# EAGLE design esp32_guitar_tuner (EAGLE 9.6.2)
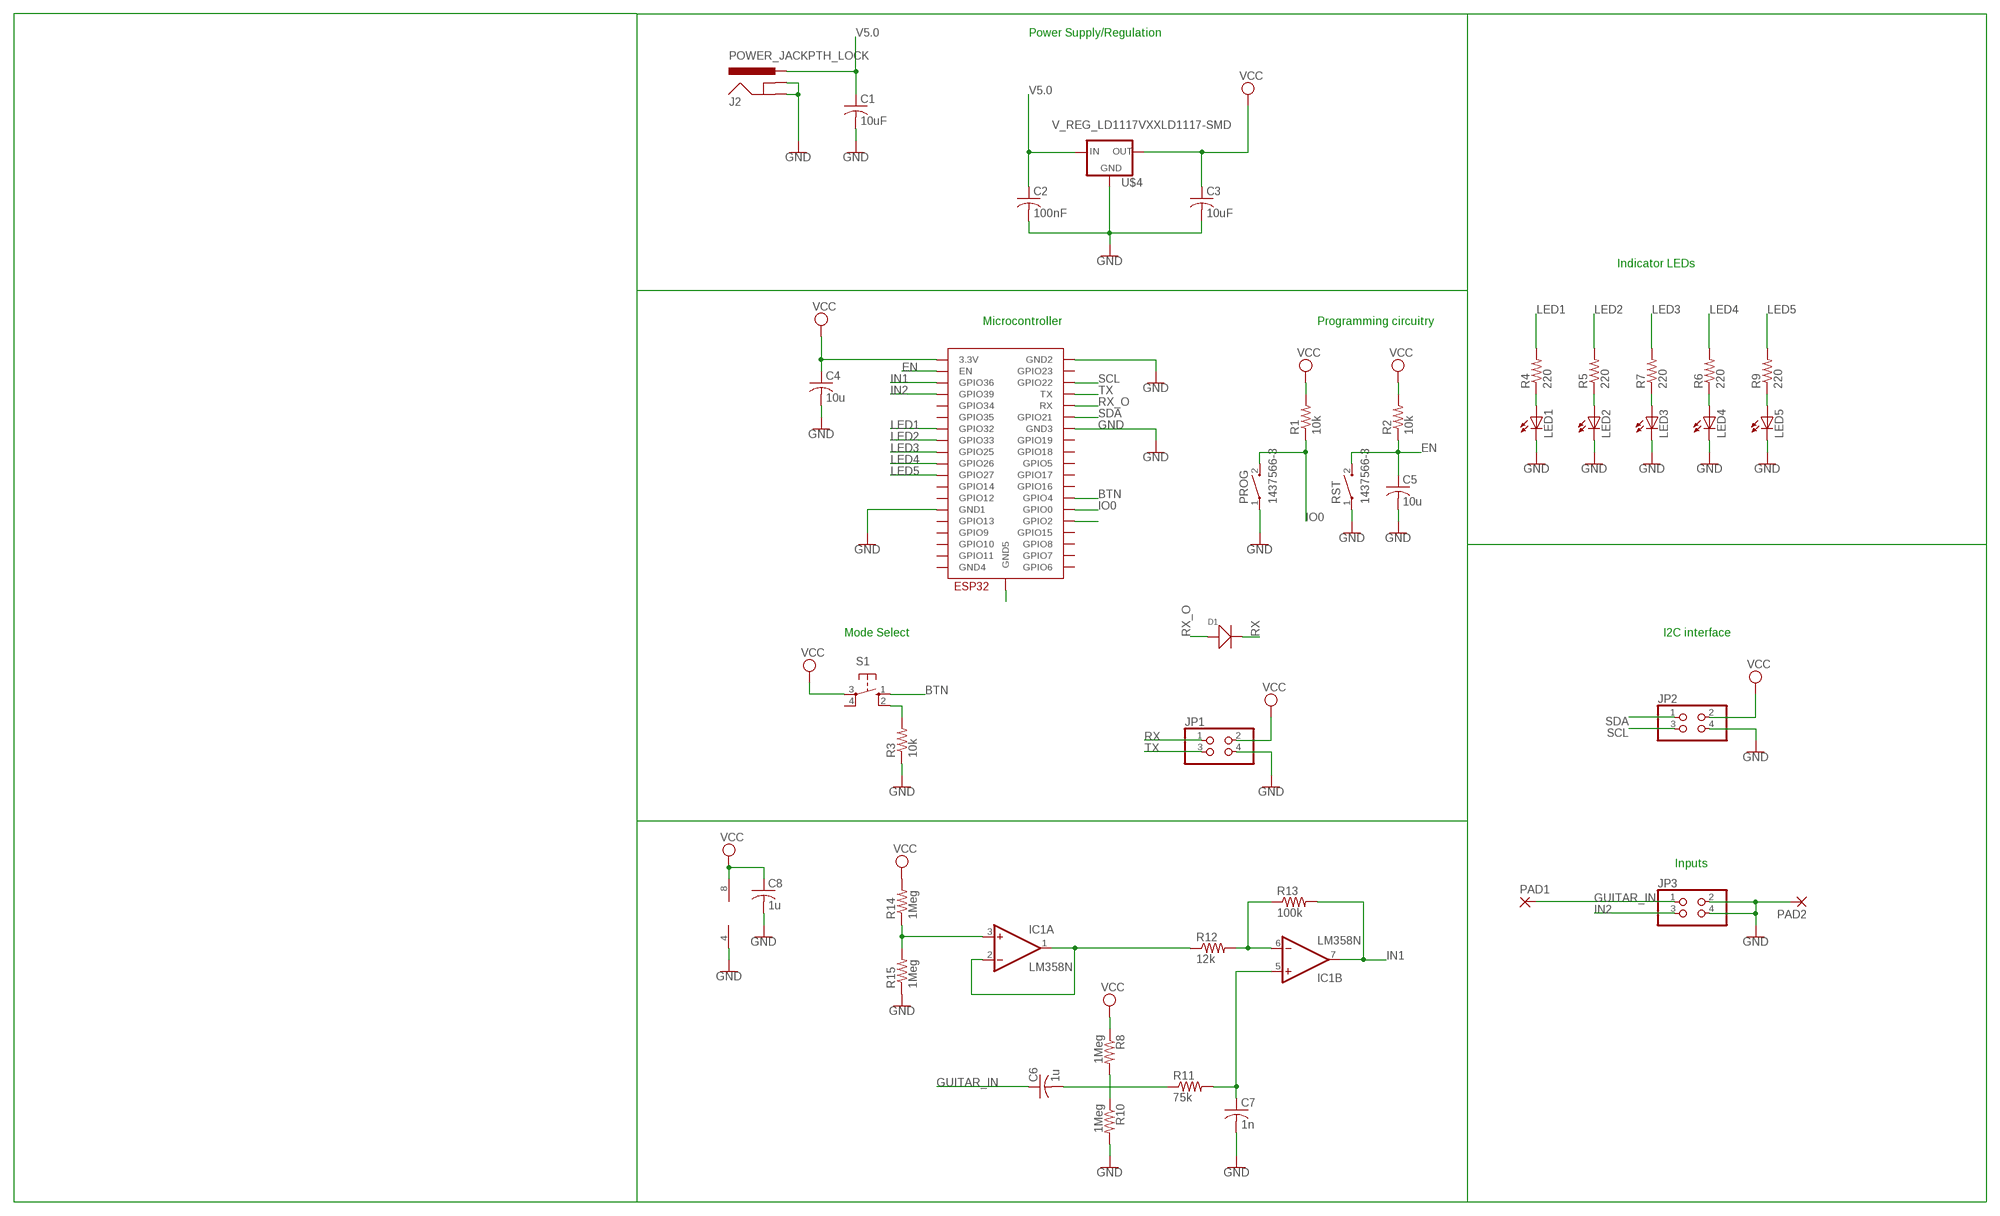
[diagram p0: schematic, sheet 1]

## Parts
C1  10uF  C-USC0805  [C0805]
C2  100nF  C-USC0805  [C0805]
C3  10uF  C-USC0805  [C0805]
C4  10u  C-USC0805  [C0805]
C5  10u  C-USC0805  [C0805]
C6  1u  C-USC0805  [C0805]
C7  1n  C-USC0805  [C0805]
C8  1u  C-USC0805  [C0805]
D1  DIODE'0805'  [SOD-323]
IC1  LM358N  [DIL08]
J2  POWER_JACKPTH_LOCK  [POWER_JACK_PTH_LOCK]
JP1  PINHD-2X2  [2X02]
JP2  PINHD-2X2  [2X02]
JP3  PINHD-2X2  [2X02]
LED1  LEDCHIPLED_0805  [CHIPLED_0805]
LED2  LEDCHIPLED_0805  [CHIPLED_0805]
LED3  LEDCHIPLED_0805  [CHIPLED_0805]
LED4  LEDCHIPLED_0805  [CHIPLED_0805]
LED5  LEDCHIPLED_0805  [CHIPLED_0805]
PAD1  SMD5  [SMD2,54-5,08]
PAD2  SMD5  [SMD2,54-5,08]
PROG  1437566-3  [SW_1437566-3]
R1  10k  R-US_R0805  [R0805]
R2  10k  R-US_R0805  [R0805]
R3  10k  R-US_R0805  [R0805]
R4  220  R-US_R0805  [R0805]
R5  220  R-US_R0805  [R0805]
R6  220  R-US_R0805  [R0805]
R7  220  R-US_R0805  [R0805]
R8  1Meg  R-US_R0805  [R0805]
R9  220  R-US_R0805  [R0805]
R10  1Meg  R-US_R0805  [R0805]
R11  75k  R-US_R0805  [R0805]
R12  12k  R-US_R0805  [R0805]
R13  100k  R-US_R0805  [R0805]
R14  1Meg  R-US_R0805  [R0805]
R15  1Meg  R-US_R0805  [R0805]
RST  1437566-3  [SW_1437566-3]
S1  10-XX  [B3F-10XX]
U$1  ESP32-WROOM  [ESP32-WROOM]
U$4  V_REG_LD1117VXXLD1117-SMD  [SOT223]

## Nets
ALARM: U$1.IO2(GPIO2)
BTN: S1.1(S) U$1.IO4(GPIO4)
EN: C5.1 R2.1 RST.2 U$1.EN
GND [GND]: C1.2 C2.2 C3.2 C4.2 C5.2 C7.2 C8.2 IC1.4(P:V-) J2.GND J2.GNDBREAK JP1.4 JP2.4 JP3.2 JP3.4 LED1.C LED2.C LED3.C LED4.C LED5.C PAD2.1(P) PROG.1 R3.1 R10.2 R15.1 RST.1 U$1.GND1 U$1.GND2 U$1.GND3 U$4.1(GND)
GUITAR_IN: C6.1 JP3.1 PAD1.1(P)
IN1: IC1.7(B:OUT) R13.2 U$1.SENSOR_VP(GPIO36)
IN2: JP3.3 U$1.SENSOR_VN(GPIO39)
IO0: PROG.2 R1.1 U$1.IO0(GPIO0)
LED1: R4.2 U$1.IO32(GPIO32)
LED2: R5.2 U$1.IO33(GPIO33)
LED3: R7.2 U$1.IO25(GPIO25)
LED4: R6.2 U$1.IO26(GPIO26)
LED5: R9.2 U$1.IO27(GPIO27)
N$1: R3.2 S1.2(S1)
N$3: LED2.A R5.1
N$4: LED4.A R6.1
N$5: LED1.A R4.1
N$6 [GND]: U$1.GND5
N$7: LED3.A R7.1
N$8: C6.2 R11.1
N$9: LED5.A R9.1
N$10: R8.2 R10.1
N$11: C7.1 IC1.5(B:+IN) R11.2
N$12: IC1.6(B:-IN) R12.2 R13.1
N$14: IC1.1(A:OUT) IC1.2(A:-IN) R12.1
N$15: IC1.3(A:+IN) R14.1 R15.2
RX: D1.- JP1.1
RX_O: D1.+ U$1.RX
SCL: JP2.3 U$1.IO22(GPIO22)
SDA: JP2.1 U$1.IO21(GPIO21)
TX: JP1.3 U$1.TX
V5.0 [PWR]: C1.1 C2.1 J2.PWR U$4.3(IN)
VCC [PWR]: C3.1 C4.1 C8.1 IC1.8(P:V+) JP1.2 JP2.2 R1.2 R2.2 R8.1 R14.2 S1.3(P) U$1.3V3(3.3V) U$4.2(OUT)
Unconnected: S1.4(P1) U$1.CLK(GPIO6) U$1.CMD(GPIO11) U$1.GND4 U$1.IO5(GPIO5) U$1.IO12(GPIO12) U$1.IO13(GPIO13) U$1.IO14(GPIO14) U$1.IO15(GPIO15) U$1.IO16(GPIO16) U$1.IO17(GPIO17) U$1.IO18(GPIO18) U$1.IO19(GPIO19) U$1.IO23(GPIO23) U$1.IO34(GPIO34) U$1.IO35(GPIO35) U$1.SD0(GPIO7) U$1.SD1(GPIO8) U$1.SD2(GPIO9) U$1.SD3(GPIO10)

## Notes on the sheet
- Power Supply/Regulation
- Indicator LEDs
- Microcontroller | Programming circuitry
- Mode Select | I2C interface
- Inputs

## Library data of the parts
C1-C8 = adafruit:C-US: CAPACITOR, American symbol
D1 = Seeed-OPL-Diode:DIODE*
IC1 = linear:LM358: OP AMP also LM158; LM258; LM2904 Source: http://cache.national.com/ds/LM/LM158.pdf
J2 = SparkFun-Connectors:POWER_JACK: Power Jack Connector This is the standard 5.5mm barrel jack for power. The PTH is the most common, proven, reliable, footprint. The Slot footprint only works if the mill layer is transmitted to the PCB fab house so be warned. Here are the connectors we sell at SparkFun: DC Barrel Power Jack/Connector <https://www.sparkfun.com/products/119> (PRT-00119) DC Barrel Power Jack/Connector (SMD) <https://www.sparkfun.com/products/12748> (PRT-12748) DC Barrel Jack Adapter - Breadboard Compatible <https://www.sparkfun.com/products/10811> (PRT-10811) It is used on this SparkFun product (and many, many others): SparkFun RedBoard - Programmed with Arduino <https://www.sparkfun.com/products/12757> (DEV-12757) Also, if you need a mating power supply or connector, please check these out: Wall Adapter Power Supply - 9VDC 650mA <https://www.sparkfun.com/products/298> (TOL-00298) DC Barrel Jack Adapter - Male <https://www.sparkfun.com/products/10287> (PRT-10287); PROD_ID: CONN-08197; SF_ID: PRT-00119
JP1-JP3 = pinhead:PINHD-2X2: PIN HEADER
LED1-LED5 = adafruit:LED: LED OSRAM: - CHIPLED LG R971, LG N971, LY N971, LG Q971, LY Q971, LO R971, LY R971 LH N974, LH R974 LS Q976, LO Q976, LY Q976 LO Q996 - Hyper CHIPLED LW Q18S LB Q993, LB Q99A, LB R99A - SideLED LS A670, LO A670, LY A670, LG A670, LP A670 LB A673, LV A673, LT A673, LW A673 LH A674 LY A675 LS A676, LA A676, LO A676, LY A676, LW A676 LS A679, LY A679, LG A679 - Hyper Micro SIDELED® LS Y876, LA Y876, LO Y876, LY Y876 LT Y87S - SmartLED LW L88C, LW L88S LB L89C, LB L89S, LG L890 LS L89K, LO L89K, LY L89K LS L896, LA L896, LO L896, LY L896 - TOPLED LS T670, LO T670, LY T670, LG T670, LP T670 LSG T670, LSP T670, LSY T670, LOP T670, LYG T670 LG T671, LOG T671, LSG T671 LB T673, LV T673, LT T673, LW T673 LH T674 LS T676, LA T676, LO T676, LY T676, LB T676, LH T676, LSB T676, LW T676 LB T67C, LV T67C, LT T67C, LS T67K, LO T67K, LY T67K, LW E67C LS E67B, LA E67B, LO E67B, LY E67B, LB E67C, LV E67C, LT E67C LW T67C LS T679, LY T679, LG T679 LS T770, LO T770, LY T770, LG T770, LP T770 LB T773, LV T773, LT T773, LW T773 LH T774 LS E675, LA E675, LY E675, LS T675 LS T776, LA T776, LO T776, LY T776, LB T776 LHGB T686 LT T68C, LB T68C - Hyper Mini TOPLED® LB M676 - Mini TOPLED Santana® LG M470 LS M47K, LO M47K, LY M47K Source: http://www.osram.convergy.de/
PAD1 PAD2 = wirepad:SMD5: SMD PAD
PROG RST = 1437566-3:1437566-3: Switch Tactile OFF (ON) SPST Rectangular Button Gull Wing 0.05A 12VDC SMD Loose Piece; AVAILABILITY: Unavailable; COMMENT: 1437566-3; CONFIGURATION_POLE-THROW: Single Pole - Single Throw; CONTACT_CURRENT_RATING: 50 mA; DESCRIPTION: Tactile Switch SPST-NO Top Actuated Surface Mount; MF: TE Connectivity; MP: 1437566-3; PACKAGE: None; PRICE: None; TE_PURCHASE_URL: https://www.te.com/usa-en/product-1437566-3.html?te_bu=Cor&te_type=disp&te_campaign=seda_glo_cor-seda-global-disp-prtnr-fy19-seda-model-bom-cta_sma-317_1&elqCampaignId=32493
R1-R15 = adafruit:R-US_: RESISTOR, American symbol
S1 = switch-omron:10-XX: OMRON SWITCH; MPN: B3F-1000; OC_FARNELL: 176432; OC_NEWARK: 36M3542
U$1 = ESP32:ESP32-WROOM
U$4 = SparkFun-IC-Power:V_REG_LD1117VXX: LD1117VXX voltage regulator. We carry the 3.3V version (COM-00526) in TO-220 package.; PROD_ID: VREG-13917

## Module ESP
Ports: 

### Library data of the parts

## Net classes
0 default: width 0.305 mm, drill 0.406 mm, clearance 0.127 mm
1 default1: width 0.305 mm, drill 0.508 mm, clearance 0.254 mm
2 GND: width 0.457 mm, drill 0.381 mm, clearance 0.127 mm
3 PWR: width 0.457 mm, drill 0.381 mm, clearance 0.127 mm

## Board
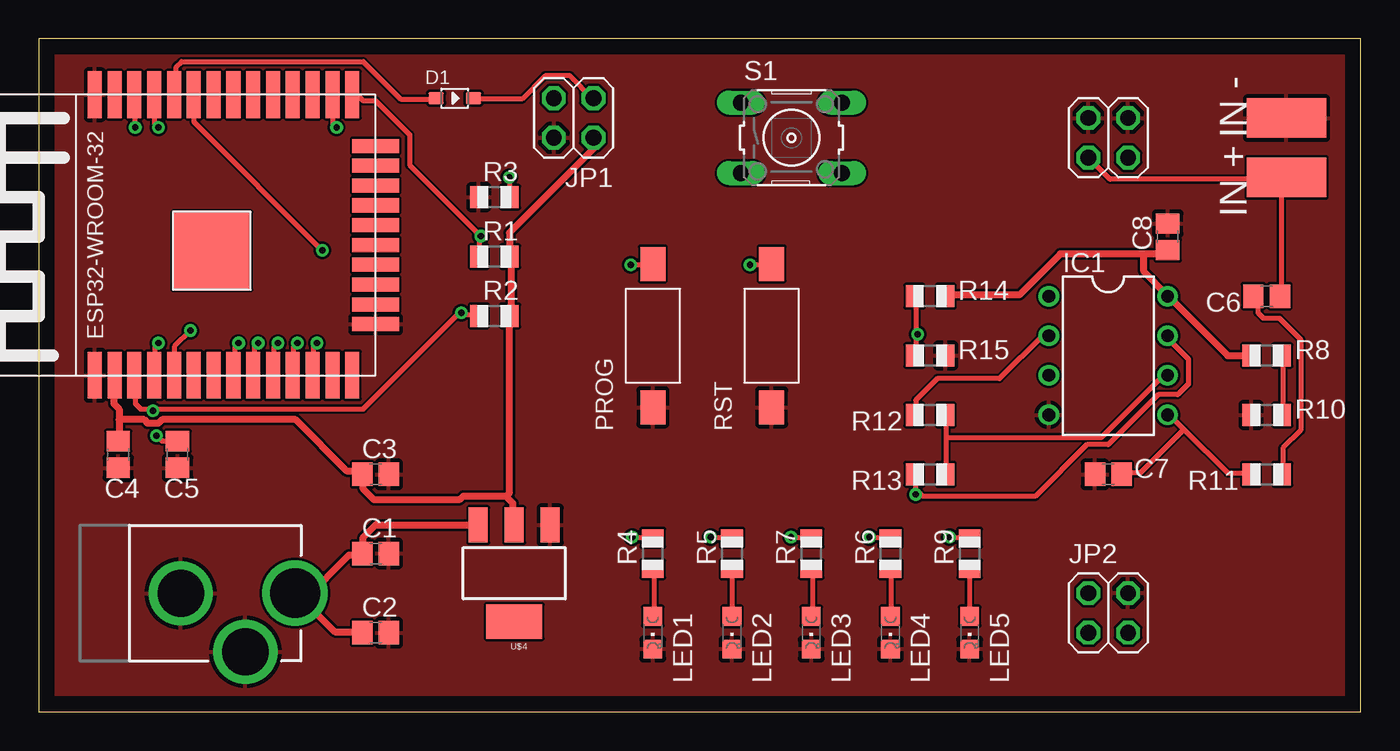
[diagram p1: board, top side]
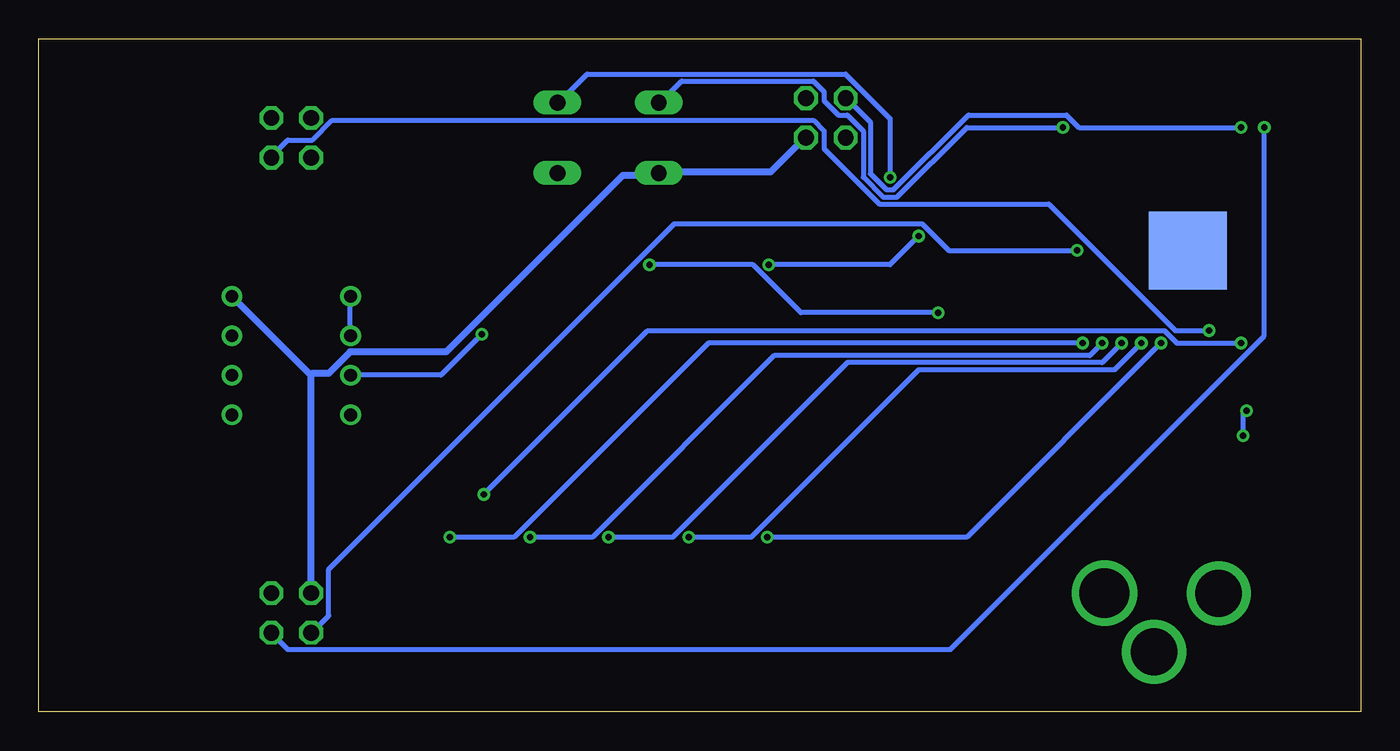
[diagram p2: board, bottom side, seen from below]

Size 84.76 x 43.17 mm. Coordinates in mm from the lower left corner, seen from the top.
Outline: 0,0 84.76,0 84.76,43.17 0,43.17 0,0
Copper layers (1*16): Top 0.035mm / dielectric 1.5mm / Bottom 0.035mm
Design rules "default": minimum track width 6mil, minimum drill 0.35mm, track to track 6mil, track to pad 6mil, pad to pad 6mil, via to via 6mil, smd to smd 6mil, copper to edge 40mil, drill to drill 6mil, minimum pad ring 10mil, minimum via ring 8mil, stop-mask expansion 4mil, vias tented up to drill 0mil, thermal gap 10mil

### Footprints (pad centres in the part's own frame; a part is rotated, then mirrored left to right if it is on the bottom)
C0805 = smd 1.3 x 1.5: 1 -0.85,0; 2 0.85,0
SOD-323 = smd 1 x 0.8: + -1.2,0; - 1.2,0
DIL08 = drill 0.813 pad 1.27: 1 -3.81,-3.81; 2 -1.27,-3.81; 3 1.27,-3.81; 4 3.81,-3.81; 5 3.81,3.81; 6 1.27,3.81; 7 -1.27,3.81; 8 -3.81,3.81
POWER_JACK_PTH_LOCK = drill 2.997 pad 4.115: GND 0.025,6.557; GNDBREAK 3.762,10.7 | drill 3.2 pad 4.115: PWR 0,13.878
2X02 = drill 1.016 octagon: 1 -1.27,-1.27; 2 -1.27,1.27; 3 1.27,-1.27; 4 1.27,1.27
CHIPLED_0805 = smd 1.2 x 1.2: A 0,-1.05; C 0,1.05
SMD2,54-5,08 = smd 2.54 x 5.08: 1 0,0
SW_1437566-3 = smd 2.18 x 1.6: 1 -4.6,0; 2 4.6,0
R0805 = smd 1.1 x 1.4: 1 -1,0; 2 1,0
B3F-10XX = drill 1.016 long: 1 -3.251,2.261; 2 3.251,2.261; 3 -3.251,-2.261; 4 3.251,-2.261
ESP32-WROOM = smd 3 x 0.9: 3V3 0,16.74; EN 0,15.47; GND1 0,18.01; GND3 18,18.01; IO0 18,1.5; IO4 18,2.77; IO5 18,6.58; IO12 0,1.5; IO14 0,2.77; IO16 18,4.04; IO17 18,5.31; IO18 18,7.85; IO19 18,9.12; IO21 18,11.66; IO22 18,15.47; IO23 18,16.74; IO25 0,6.58; IO26 0,5.31; IO27 0,4.04; IO32 0,9.12; IO33 0,7.85; IO34 0,11.66; IO35 0,10.39; NC 18,10.39; RX 18,12.93; SENSOR_VN 0,12.93; SENSOR_VP 0,14.2; TX 18,14.2 | smd 0.9 x 3: CLK 9.635,0; CMD 8.365,0; GND2 3.285,0; IO2 14.715,0; IO13 4.555,0; IO15 13.445,0; SD0 10.905,0; SD1 12.175,0; SD2 5.825,0; SD3 7.095,0 | smd 5 x 5: GND4 8,10.5 | smd 5 x 5 bottom: GND5 8,10.5
SOT223 = smd 1.219 x 2.235: 1 -2.311,-3.099; 2 0,-3.099; 3 2.311,-3.099 | smd 3.6 x 2.2: 4 0,3.099

### Placement (x,y rotation side)
C1  21.59,10.16 0 top
C2  21.59,5.08 0 top
C3  21.59,15.24 0 top
C4  5.08,16.51 270 top
C5  8.89,16.51 270 top
C6  78.74,26.67 180 top
C7  68.58,15.24 180 top
C8  72.39,30.48 90 top
D1  26.67,39.37 0 top
IC1  68.58,22.86 270 top
J2  2.54,7.62 270 top
JP1  34.29,38.1 180 top
JP2  68.58,6.35 0 top
JP3  68.58,36.83 0 top
LED1  39.37,5.08 180 top
LED2  44.45,5.08 180 top
LED3  49.53,5.08 180 top
LED4  54.61,5.08 180 top
LED5  59.69,5.08 180 top
PAD1  80.01,34.29 90 top
PAD2  80.01,38.1 270 top
PROG  39.37,24.13 90 top
R1  29.21,29.21 0 top
R2  29.21,25.4 0 top
R3  29.21,33.02 0 top
R4  39.37,10.16 90 top
R5  44.45,10.16 90 top
R6  54.61,10.16 90 top
R7  49.53,10.16 90 top
R8  78.74,22.86 0 top
R9  59.69,10.16 90 top
R10  78.74,19.05 180 top
R11  78.74,15.24 180 top
R12  57.15,19.05 0 top
R13  57.15,15.24 180 top
R14  57.15,26.67 0 top
R15  57.15,22.86 180 top
RST  46.99,24.13 90 top
S1  48.26,36.83 0 top
U$1  21.59,21.59 90 top
U$4  30.48,8.89 180 top

### Tracks (layer width: path | path; a pad name or v marks a point on that pad's centre or on a via)
BTN  (via drill 0.41)
  Top 0.305: v19.09,37.49 18.86,37.72 18.86,39.55 U$1.IO4
  Bottom 0.305: v19.09,37.49 25.26,37.49 29.72,33.03 30.63,33.03 31.89,34.29 31.89,37.26 32.92,38.29 33.49,38.29 34.4,39.2 34.4,39.78 35.09,40.46 43.55,40.46 44.92,39.09 S1.1
EN  (via drill 0.41)
  Top 0.305: 27.09,25.49 26.86,25.49 20.8,19.43 7.32,19.43 | 27.09,25.49 28.12,25.49 R2.1 | 7.32,19.43 6.51,19.43 6.17,19.77 6.17,21.49 U$1.EN | v7.54,17.72 7.89,17.37 8.8,17.37 C5.1 | v7.32,19.32 7.32,19.43 | v45.61,28.69 46.98,28.69 RST.2 | v27.09,25.6 27.09,25.49
  Bottom 0.305: v7.54,17.72 7.54,19.09 v7.32,19.32 | v45.61,28.69 38.98,28.69 35.89,25.6 v27.09,25.6
GND
  pour Top: -1.27,44.45 -1.27,-1.27 101.6,-1.27 101.6,44.45
GUITAR_IN
  Top 0.305: C6.1 79.67,26.75 79.67,33.95 PAD1.1 79.55,33.95 79.32,34.18 68.69,34.18 JP3.1
IN1  (via drill 0.41)
  Top 0.305: 56.41,14.12 56.69,13.83 63.89,13.83 67.21,17.14 68.58,17.14 71.78,20.34 73.04,20.34 73.72,21.03 73.72,22.63 72.47,23.89 72.47,24.12 IC1.7 | 56.41,14.12 56.24,14.29 56.24,15.2 R13.2 | v7.66,23.66 7.43,23.43 7.43,21.6 U$1.SENSOR_VP | 56.41,14.12 v56.24,13.95
  Bottom 0.305: v7.66,23.66 11.77,23.66 12.57,24.46 45.72,24.46 v56.24,13.95
IN2  (via drill 0.41)
  Top 0.305: v9.72,24.46 8.69,23.43 8.69,21.6 U$1.SENSOR_VN
  Bottom 0.305: v9.72,24.46 11.89,24.46 20,32.58 30.86,32.58 34.4,36.12 34.4,37.26 35.09,37.95 65.95,37.95 67.21,36.69 68.81,36.69 69.84,35.66 JP3.3
IO0  (via drill 0.41)
  Top 0.305: 28.23,30.52 28.23,30.63 23.77,35.09 23.77,37.03 21.6,39.2 20.8,39.2 20.34,39.66 20.12,39.66 U$1.IO0 | 28.23,30.52 28.23,29.26 R1.1 | v37.95,28.69 39.32,28.69 PROG.2 | v28.35,30.52 28.23,30.52
  Bottom 0.305: v37.95,28.69 30.18,28.69 v28.35,30.52
LED1  (via drill 0.41)
  Top 0.305: v38.06,11.2 39.32,11.2 R4.2 | v12.8,23.66 12.57,23.43 12.57,21.6 U$1.IO32
  Bottom 0.305: v38.06,11.2 25.26,11.2 v12.8,23.66
LED2  (via drill 0.41)
  Top 0.305: v43.09,11.2 44.35,11.2 R5.2 | v14.06,23.66 13.83,23.43 13.83,21.6 U$1.IO33
  Bottom 0.305: v43.09,11.2 39.09,11.2 28.35,21.95 15.77,21.95 v14.06,23.66
LED3  (via drill 0.41)
  Top 0.305: v48.23,11.2 49.49,11.2 R7.2 | v15.32,23.66 15.09,23.43 15.09,21.6 U$1.IO25
  Bottom 0.305: v48.23,11.2 44.12,11.2 32.92,22.4 16.57,22.4 v15.32,23.66
LED4  (via drill 0.41)
  Top 0.305: v53.26,11.2 54.52,11.2 R6.2 | v16.57,23.66 16.34,23.43 16.34,21.6 U$1.IO26
  Bottom 0.305: v53.26,11.2 49.26,11.2 37.6,22.86 17.37,22.86 v16.57,23.66
LED5  (via drill 0.41)
  Top 0.305: v58.41,11.2 59.66,11.2 R9.2 | v17.83,23.66 17.6,23.43 17.6,21.6 U$1.IO27
  Bottom 0.305: v58.41,11.2 54.29,11.2 41.83,23.66 v17.83,23.66
N$1  (via drill 0.41)
  Top 0.305: v30.18,34.29 30.18,33.03 R3.2
  Bottom 0.305: v30.18,34.29 30.18,38.06 33.03,40.92 49.61,40.92 51.44,39.09 S1.2
N$3
  Top 0.305: LED2.A 44.46,6.17 44.46,9.14 R5.1
N$4
  Top 0.305: LED4.A 54.63,6.17 54.63,9.14 R6.1
N$5
  Top 0.305: LED1.A 39.43,6.17 39.43,9.14 R4.1
N$7
  Top 0.305: LED3.A 49.61,6.17 49.61,9.14 R7.1
N$8
  Top 0.305: R11.1 79.78,15.32 79.78,16.92 80.92,18.06 80.92,23.89 79.55,25.26 78.52,25.26 78.18,25.6 78.18,26.4 77.95,26.63 C6.2
N$9
  Top 0.305: LED5.A 59.66,6.17 59.66,9.14 R9.1
N$10
  Top 0.305: R10.1 79.78,19.09 79.78,22.86 R8.2
N$11
  Top 0.305: 73.44,18.12 72.47,19.09 IC1.5 | 73.44,18.12 76.24,15.32 77.72,15.32 R11.2 | 73.44,18.12 70.64,15.32 69.49,15.32 C7.1
N$12
  Top 0.305: 58.18,17.6 58.18,18.97 R12.2 | 58.18,17.6 58.18,15.32 R13.1 | 58.18,17.6 68.12,17.6 72.01,21.49 72.35,21.49 IC1.6
N$14
  Top 0.305: R12.1 56.24,19.09 56.24,20 57.61,21.37 61.61,21.37 64.35,24.12 64.69,24.12 IC1.2
  Bottom 0.305: IC1.1 64.81,26.63 64.81,24.23 IC1.2
N$15  (via drill 0.41)
  Top 0.305: 56.24,24.23 56.24,26.63 R14.1 | 56.24,24.23 56.24,22.86 R15.2 | v56.35,24.23 56.24,24.23
  Bottom 0.305: v56.35,24.23 58.98,21.6 64.69,21.6 IC1.3
RX
  Top 0.305: D1.- 27.89,39.32 30.98,39.32 32.46,40.8 34.06,40.8 35.55,39.32 JP1.1
RX_O
  Top 0.305: D1.+ 25.38,39.32 23.2,39.32 20.8,41.72 9.14,41.72 8.8,41.38 8.8,39.78 8.69,39.66 U$1.RX
SCL  (via drill 0.41)
  Top 0.305: v6.17,37.49 6.17,39.55 U$1.IO22
  Bottom 0.305: v6.17,37.49 6.17,24.12 26.29,4 68.81,4 69.84,5.03 JP2.3
SDA  (via drill 0.41)
  Top 0.305: v18.17,29.6 9.94,37.83 9.94,39.55 U$1.IO21
  Bottom 0.305: v18.17,29.6 26.4,29.6 28.12,31.32 44.01,31.32 66.18,9.14 66.18,6.17 67.21,5.14 JP2.1
TX  (via drill 0.41)
  Top 0.305: v7.66,37.49 7.43,37.72 7.43,39.55 U$1.TX
  Bottom 0.305: v7.66,37.49 18.06,37.49 18.86,38.29 25.15,38.29 29.95,33.49 30.4,33.49 31.43,34.52 31.43,37.83 32.92,39.32 JP1.3
V5.0
  Top 0.457: C2.1 20.69,5.14 18.97,5.14 16.46,7.66 J2.PWR 17.03,7.2 19.89,10.06 20.69,10.06 C1.1 20.8,10.29 20.8,11.2 21.6,12 28.12,12 U$4.3
VCC
  Top 0.457: 70.87,29.38 72.12,29.38 72.35,29.6 C8.1 | 70.87,29.38 65.49,29.38 62.87,26.75 58.18,26.75 R14.2 | R8.1 76.24,22.86 72.47,26.63 IC1.8 72.35,26.75 70.87,28.23 70.87,29.38 | JP1.2 35.66,36.8 35.66,36.23 30.18,30.75 30.18,29.38 R1.2 30.29,29.15 30.29,25.49 R2.2 30.18,25.26 30.18,14.06 29.95,13.83 | 5.14,18.75 5.14,19.43 4.8,19.77 4.8,21.49 U$1.3V3 | 5.14,18.75 5.14,17.37 C4.1 | 29.95,13.83 27.2,13.83 26.98,13.6 21.49,13.6 20.8,14.29 20.8,15.2 C3.1 20.69,15.43 19.77,15.43 16.46,18.75 7.89,18.75 7.66,18.52 6.97,18.52 6.74,18.75 5.14,18.75 | 29.95,13.83 30.4,13.37 30.4,12 U$4.2
  Bottom 0.457: 67.32,21.6 67.32,7.66 JP2.2 | IC1.8 67.32,21.6 | JP1.2 35.66,36.8 37.83,34.63 44.92,34.63 S1.3 45.15,34.4 47.32,34.4 58.64,23.09 64.81,23.09 66.18,21.72 67.21,21.72 67.32,21.6

### Text on the board
tNames: IN - | IN +